# Altium schematic sheet POWER.SchDoc
size Legal
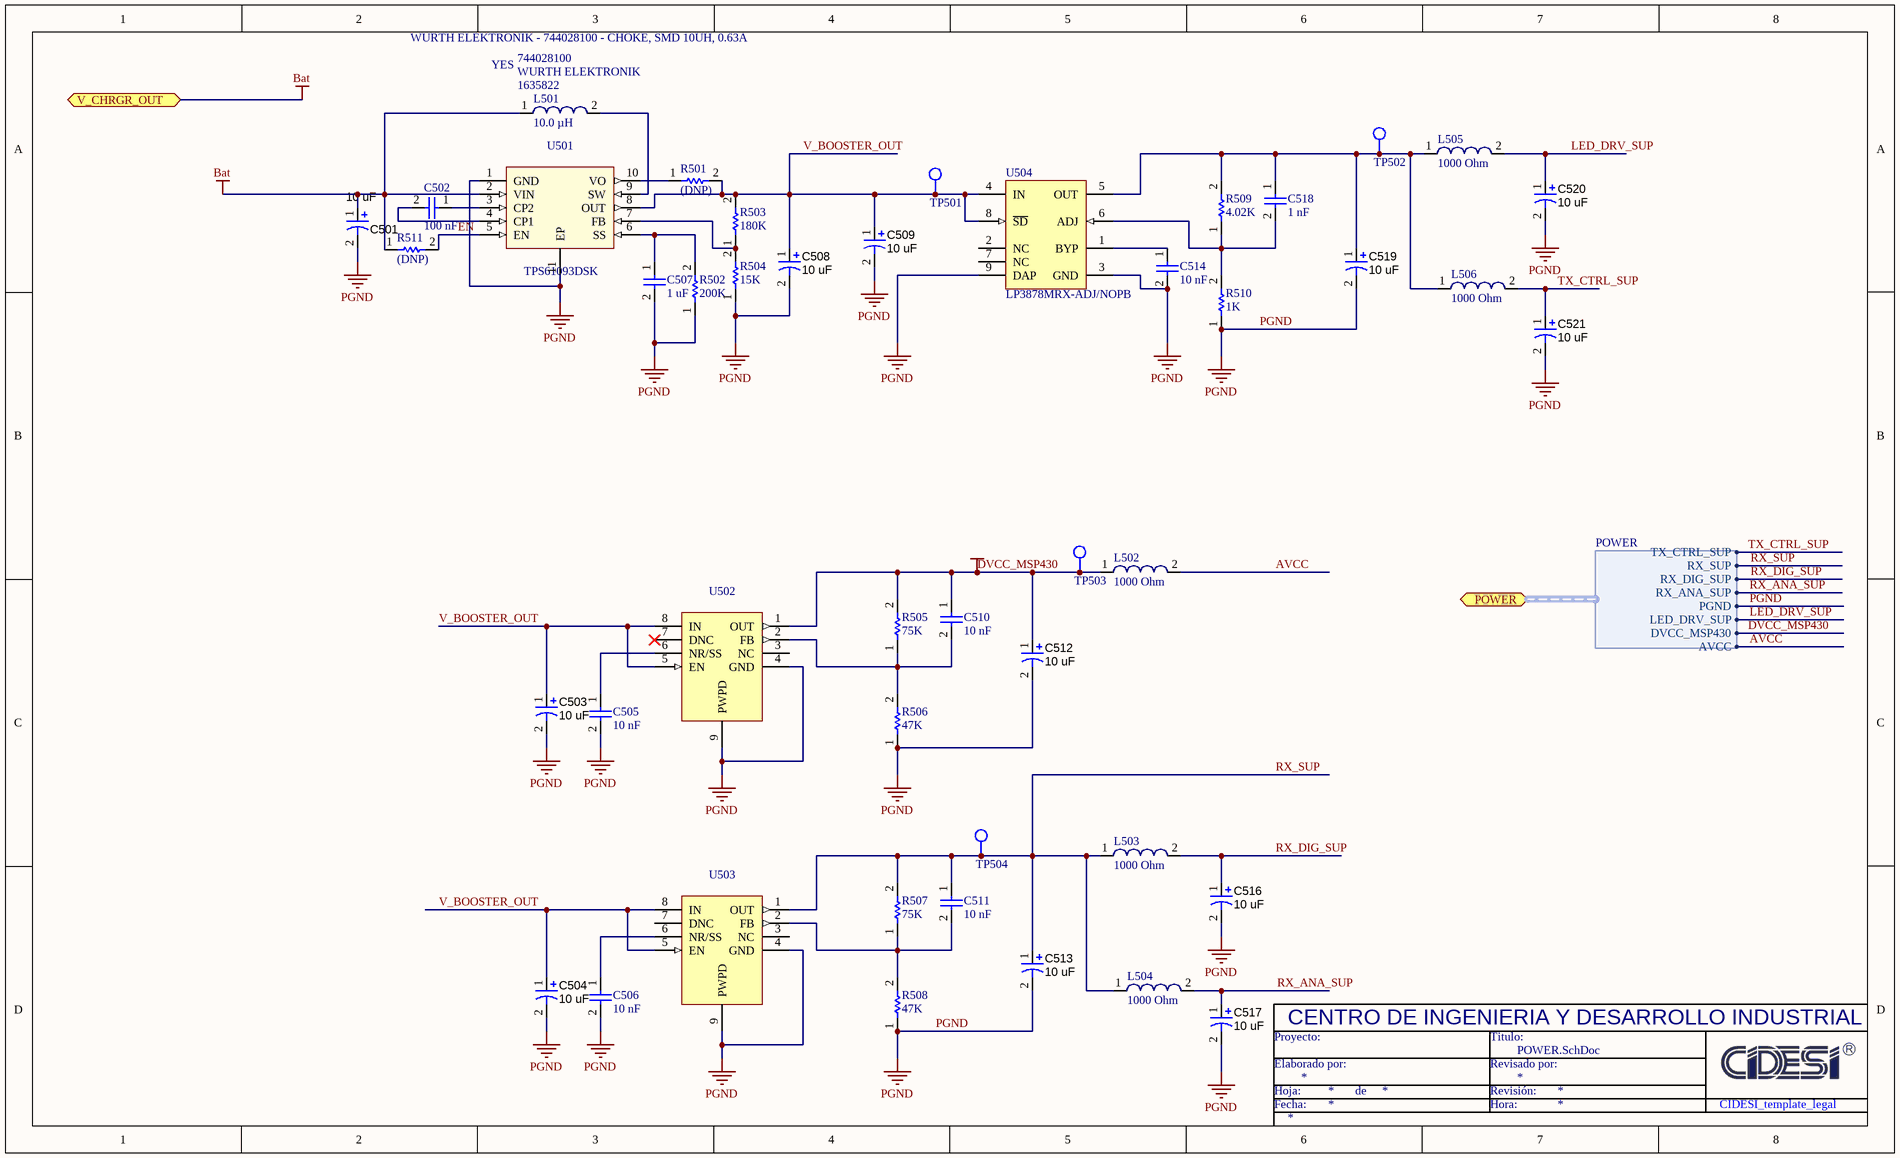
[diagram p0: POWER.SchDoc]

## Parts
C501  10 uF  [C0603_P]
C502  100 nF  [C0402]
C503  10 uF  [C0603_P]
C504  10 uF  [C0603_P]
C505  10 nF  [C0402]
C506  10 nF  [C0402]
C507  1 uF  [C0402]
C508  10 uF  [C0603_P]
C509  10 uF  [C0603_P]
C510  10 nF  [C0402]
C511  10 nF  [C0402]
C512  10 uF  [C0603_P]
C513  10 uF  [C0603_P]
C514  10 nF  [C0402]
C516  10 uF  [C0603_P]
C517  10 uF  [C0603_P]
C518  1 nF  [C0402]
C519  10 uF  [C0603_P]
C520  10 uF  [C0603_P]
C521  10 uF  [C0603_P]
L501  10.0 µH  Supplier Part Number 1: 1635822  Manufacturer 1: WURTH ELEKTRONIK  Manufacturer Part Number 1: 744028100  RoHS 1: YES  Description 1: WURTH ELEKTRONIK - 744028100 - CHOKE, SMD 10UH, 0.63A  [WE-TPC 2811, T]
L502  1000 Ohm  [SMD 0402]
L503  1000 Ohm  [SMD 0402]
L504  1000 Ohm  [SMD 0402]
L505  1000 Ohm  [SMD 0402]
L506  1000 Ohm  [SMD 0402]
R501  (DNP)  [0201]
R502  200K  [0201]
R503  180K  [0201]
R504  15K  [0201]
R505  75K  [0201]
R506  47K  [0201]
R507  75K  [0201]
R508  47K  [0201]
R509  4.02K  [0201]
R510  1K  [0201]
R511  (DNP)  [0201]
TP501  Test Point  [TestPoint]  (value not drawn)  (no BOM)
TP502  Test Point  [TestPoint]  (value not drawn)  (no BOM)
TP503  Test Point  [TestPoint]  (value not drawn)  (no BOM)
TP504  Test Point  [TestPoint]  (value not drawn)  (no BOM)
U501  TPS61093DSK  [DSK]
U502  TPS7A4901DGN  [DGN_8P]  (value not drawn)
U503  TPS7A4901DGN  [DGN_8P]  (value not drawn)
U504  LP3878MRX-ADJ/NOPB  [NGT]

## Ports
POWER (harness POWER), V_CHRGR_OUT (bidir)

## Harnesses
POWER: AVCC, DVCC_MSP430, LED_DRV_SUP, PGND, RX_ANA_SUP, RX_DIG_SUP, RX_SUP, TX_CTRL_SUP

## Nets
Bat: C501.1(+) L501.1 R511.1 U501.2(VIN) ; port V_CHRGR_OUT
DVCC_MSP430: C510.1 C512.1(+) L502.1 R505.2 TP503.1 U502.1(OUT) ; port POWER.DVCC_MSP430
PGND: C501.2(-) C503.2(-) C504.2(-) C505.2 C506.2 C507.2 C508.2(-) C509.2(-) C512.2(-) C513.2(-) C514.2 C516.2(-) C517.2(-) C519.2(-) C520.2(-) C521.2(-) R502.1 R504.1 R506.1 R508.1 R510.1 U501.1(GND) U501.11(EP) U502.4(GND) U502.9(PWPD) U503.4(GND) U503.9(PWPD) U504.3(GND) U504.9(DAP) ; port POWER.PGND
AVCC: L502.2 ; port POWER.AVCC
EN: R511.2 U501.5(EN)
LED_DRV_SUP: C520.1(+) L505.2 ; port POWER.LED_DRV_SUP
RX_ANA_SUP: C517.1(+) L504.2 ; port POWER.RX_ANA_SUP
RX_DIG_SUP: C516.1(+) L503.2 ; port POWER.RX_DIG_SUP
RX_SUP: C511.1 C513.1(+) L503.1 L504.1 R507.2 TP504.1 U503.1(OUT) ; port POWER.RX_SUP
TX_CTRL_SUP: C521.1(+) L506.2 ; port POWER.TX_CTRL_SUP
V_BOOSTER_OUT: C503.1(+) C504.1(+) C508.1(+) C509.1(+) R501.2 R503.2 TP501.1 U501.8(OUT) U502.5(EN) U502.8(IN) U503.5(EN) U503.8(IN) U504.4(IN) U504.8(~{SD})
NetC502_1: C502.1 U501.3(CP2)
NetC502_2: C502.2 U501.4(CP1)
NetC505_1: C505.1 U502.6(NR/SS)
NetC506_1: C506.1 U503.6(NR/SS)
NetC507_1: C507.1 R502.2 U501.6(SS)
NetC510_2: C510.2 R505.1 R506.2 U502.2(FB)
NetC511_2: C511.2 R507.1 R508.2 U503.2(FB)
NetC514_1: C514.1 U504.1(BYP)
NetC518_1: C518.1 C519.1(+) L505.1 L506.1 R509.2 TP502.1 U504.5(OUT)
NetC518_2: C518.2 R509.1 R510.2 U504.6(ADJ)
NetL501_2: L501.2 U501.9(SW)
NetR501_1: R501.1 U501.10(VO)
NetR503_1: R503.1 R504.2 U501.7(FB)

Not connected (* = marked no-connect by the designer): U502 3(NC) 7(DNC)*; U503 3(NC) 7(DNC); U504 2(NC) 7(NC)

## Notes on the sheet
- Proyecto:
- CENTRO DE INGENIERIA Y DESARROLLO INDUSTRIAL
- Titulo:
- Fecha:
- Hoja:
- Elaborado por:
- de
- Hora:
- Revisión:
- Revisado por:
- CIDESI_template_legal

## Library data of the parts
C501 C503 C504 C508 C509 C512 C513 C516 C517 C519-C521 = F981A106MMA: NICHICON - F981A106MMA - CAPACITOR TANT, 10UF, 10V 20%; Product Range: NICHICON - F98 Series; Capacitance: 10; Capacitor Case Style: 0603 ^1608 Metric]; ESR: 7.5; Value: 10 uF; Supplier 1: Farnell; Stock 1: 9201; Pricing 1: 1=0.282, 10=0.236, 100=0.169, 250=0.148, 500=0.131, 1000=0.117 (GBP); Capacitance Tolerance: ± 20%; Voltage Rating: 10; Operating Temperature Max: 125; Series: F98; ComponentLink1URL: http://www.nichicon.co.jp/english/products/pdfs/e-f98.pdf; ComponentLink1Description: http://www.nichicon.co.jp/english/products/pdfs/e-f98.pdf; Supplier Part Number 1: 1853431; Manufacturer 1: NICHICON; Manufacturer Part Number 1: F981A106MMA; RoHS 1: YES; Description 1: NICHICON - F981A106MMA - CAPACITOR TANT, 10UF, 10V 20%; Supplier 2: Mouser; Supplier Part Number 2: 647-F981A106MMA
C502 = C1005X7R1H104M050BB: TDK - C1005X7R1H104M050BB - CAP CERAMIC, 0.1UF, 50V, X7R, 0402; Value: 100 nF; Supplier 1: Farnell; Stock 1: 15712; Pricing 1: 1=0.021, 10=0.012, 100=0.01, 1000=0.009, 4000=0.009, 8000=0.009 (GBP); ComponentLink1URL: http://product.tdk.com/capacitor/mlcc/en/documents/mlcc_commercial_general_en.pdf; ComponentLink1Description: http://product.tdk.com/capacitor/mlcc/en/documents/mlcc_commercial_general_en.pdf; Supplier Part Number 1: 2354090; Manufacturer 1: TDK; Manufacturer Part Number 1: C1005X7R1H104M050BB; RoHS 1: YES; Description 1: TDK - C1005X7R1H104M050BB - CAP CERAMIC, 0.1UF, 50V, X7R, 0402; Supplier 2: Mouser; Supplier Part Number 2: 810-C1005X7R1H104M
C505 C506 C510 C511 C514 = C1005X7R1H103K050BB: TDK - C1005X7R1H103K050BB - CAP CERAMIC, 0.01UF, 50V, X7R, 0402; Product Range: TDK - C Series; Capacitance: 0.01; Capacitance Tolerance: ± 10%; Dielectric Characteristic: X7; Voltage Rating: 50; Capacitor Case Style: 0402 ^1005 Metric]; Value: 10 nF; Supplier 1: Farnell; Stock 1: 36; Pricing 1: 1=0.011, 10=0.005, 100=0.005, 1000=0.005, 2500=0.005 (GBP); Packaging: Cut Tape; MSL: -; ComponentLink1URL: http://product.tdk.com/capacitor/mlcc/en/documents/mlcc_commercial_general_en.pdf; ComponentLink1Description: http://product.tdk.com/capacitor/mlcc/en/documents/mlcc_commercial_general_en.pdf; Supplier Part Number 1: 2354088; Manufacturer 1: TDK; Manufacturer Part Number 1: C1005X7R1H103K050BB; RoHS 1: YES; Description 1: TDK - C1005X7R1H103K050BB - CAP CERAMIC, 0.01UF, 50V, X7R, 0402; Supplier 2: Mouser; Supplier Part Number 2: 810-C1005X7R1H103K
C507 = C1005X5R1E105K050BC: TDK - C1005X5R1E105K050BC - CAP, MLCC, X5R, 1UF, 25V, 0402; Value: 1 uF; Supplier 1: Farnell; Stock 1: 5210; Pricing 1: 1=0.045, 10=0.04, 100=0.036, 250=0.029, 500=0.023, 10000=0.016 (GBP); ComponentLink1URL: http://www.farnell.com/datasheets/1796654.pdf; ComponentLink1Description: http://www.farnell.com/datasheets/1796654.pdf; Supplier Part Number 1: 2346884; Manufacturer 1: TDK; Manufacturer Part Number 1: C1005X5R1E105K050BC; RoHS 1: YES; Description 1: TDK - C1005X5R1E105K050BC - CAP, MLCC, X5R, 1UF, 25V, 0402; Supplier 2: Mouser; Supplier Part Number 2: 810-C1005X5R1E105K
C518 = C1005X7R1E102K050BA: TDK - C1005X7R1E102K050BA - CAPACITOR CERAMIC 1000PF, 25V, X7R, 10%, 0402; Value: 1 nF; Supplier 1: Farnell; Stock 1: 7460; Pricing 1: 1=0.004, 10=0.002, 100=0.002, 1000=0.002, 2500=0.002, 10000=0.002 (GBP); ComponentLink1URL: http://www.farnell.com/datasheets/1571323.pdf; ComponentLink1Description: http://www.farnell.com/datasheets/1571323.pdf; ComponentLink2URL: http://www.farnell.com/datasheets/1718611.pdf; ComponentLink2Description: http://www.farnell.com/datasheets/1718611.pdf; Supplier Part Number 1: 1844132; Manufacturer 1: TDK; Manufacturer Part Number 1: C1005X7R1E102K050BA; RoHS 1: YES; Description 1: TDK - C1005X7R1E102K050BA - CAPACITOR CERAMIC 1000PF, 25V, X7R, 10%, 0402; Supplier 2: Mouser; Supplier Part Number 2: 810-C1005X7R1E102K
L501 = WE-TPC 2811, T, 744028100: SMD Shielded Tiny Power Inductor WE-TPC, L=10.0 µH; Manufacturer: Würth Elektronik eiSos GmbH; partNo: 744028100; Inductance: 10.0 µH; ComponentLink1Description: Manufacturer; ComponentLink1URL: http://www.we-online.de; Created by: Christin Zierenner; Created Date: July 2009; ComponentLink2Description: Datasheet; ComponentLink2URL: http://www.we-online.de/katalog/media/pdf/744028100.pdf; Supplier 1: Farnell; Stock 1: 557; Pricing 1: 1=0.9, 10=0.86, 50=0.84, 100=0.81, 250=0.75 (GBP); ComponentLink3URL: http://www.farnell.com/datasheets/69345.pdf; ComponentLink3Description: http://www.farnell.com/datasheets/69345.pdf; ComponentLink4URL: http://www.farnell.com/cad/1670106.zip; ComponentLink4Description: http://www.farnell.com/cad/1670106.zip
L502-L506 = WE-CBF HF 0402, 742841210: SMD EMI Suppression Ferrite Beads WE-CBF HF, Z= 1000 Ohm; Manufacturer: Würth Elektronik eiSos GmbH; Manufacturer 1: WURTH ELEKTRONIK; Description 1: WURTH ELEKTRONIK - 742841210 - FERRITE BEAD, 1.8OHM, 50MA, 0402; partNo: 742841210; Impedance: 1000 Ohm; ComponentLink1Description: Manufacturer; ComponentLink1URL: http://www.we-online.de; Created by: Christin Zierenner; Created Date: May 2009; ComponentLink2Description: Datasheet; ComponentLink2URL: http://www.we-online.de/katalog/media/pdf/742841210.pdf; Supplier 1: Farnell; Supplier Part Number 1: 1748573; Manufacturer Part Number 1: 742841210; RoHS 1: YES; Stock 1: 220; Pricing 1: 1=0.31, 10=0.219, 50=0.19, 100=0.158, 250=0.126 (GBP); ComponentLink3URL: http://www.farnell.com/datasheets/1696154.pdf; ComponentLink3Description: http://www.farnell.com/datasheets/1696154.pdf; ComponentLink4URL: http://www.farnell.com/cad/1670055.zip; ComponentLink4Description: http://www.farnell.com/cad/1670055.zip; Supplier 2: Mouser; Supplier Part Number 2: 710-742841210
R501 R511 = CRCW02010000Z0ED: VISHAY DALE - CRCW02010000Z0ED - RESISTOR, CHIP, JUMPER, ZERO OHM, 50mW, FULL REEL; Value: 0; Supplier 1: Farnell; Stock 1: 19995; Pricing 1: 10000=0.017, 20000=0.016, 30000=0.015 (GBP); ComponentLink1URL: http://www.vishay.com/docs/20035/dcrcwe3.pdf; ComponentLink1Description: http://www.vishay.com/docs/20035/dcrcwe3.pdf; Supplier Part Number 1: 2316008; Manufacturer 1: VISHAY DALE; Manufacturer Part Number 1: CRCW02010000Z0ED; RoHS 1: YES; Description 1: VISHAY DALE - CRCW02010000Z0ED - RESISTOR, CHIP, JUMPER, ZERO OHM, 50mW, FULL REEL; Supplier 2: Mouser; Supplier Part Number 2: 71-CRCW02010000Z0ED
R502 = CRCW0201200KFNED: VISHAY DALE - CRCW0201200KFNED - RESISTOR, THICK FILM, 200 KOHM, 50 mW, 1%, FULL REEL; Value: 200K; Supplier 1: Farnell; Stock 1: 9995; Pricing 1: 10000=0.007, 20000=0.007, 30000=0.006, 50000=0.006 (GBP); ComponentLink1URL: http://www.farnell.com/datasheets/1700795.pdf; ComponentLink1Description: http://www.farnell.com/datasheets/1700795.pdf; Supplier Part Number 1: 2321987; Manufacturer 1: VISHAY DALE; Manufacturer Part Number 1: CRCW0201200KFNED; RoHS 1: Y-EX; Description 1: VISHAY DALE - CRCW0201200KFNED - RESISTOR, THICK FILM, 200 KOHM, 50 mW, 1%, FULL REEL
R503 = CRCW0201180KFNED: VISHAY DALE - CRCW0201180KFNED - RESISTOR, THICK FILM, 180 KOHM, 50 mW, 1%, FULL REEL; Value: 180K; Supplier 1: Farnell; Stock 1: 19995; Pricing 1: 10000=0.078, 20000=0.078, 30000=0.075, 50000=0.066 (GBP); ComponentLink1URL: http://www.farnell.com/datasheets/1700795.pdf; ComponentLink1Description: http://www.farnell.com/datasheets/1700795.pdf; Supplier Part Number 1: 2321951; Manufacturer 1: VISHAY DALE; Manufacturer Part Number 1: CRCW0201180KFNED; RoHS 1: YES; Description 1: VISHAY DALE - CRCW0201180KFNED - RESISTOR, THICK FILM, 180 KOHM, 50 mW, 1%, FULL REEL
R504 = CRCW020115K0FNED: VISHAY DALE - CRCW020115K0FNED - RESISTOR, THICK FILM, 15 KOHM, 50 mW, 1%, FULL REEL; Value: 15K; Supplier 1: Farnell; Stock 1: 9995; Pricing 1: 10000=0.007, 20000=0.007, 30000=0.007, 50000=0.006 (GBP); ComponentLink1URL: http://www.farnell.com/datasheets/1700795.pdf; ComponentLink1Description: http://www.farnell.com/datasheets/1700795.pdf; Supplier Part Number 1: 2321583; Manufacturer 1: VISHAY DALE; Manufacturer Part Number 1: CRCW020115K0FNED; RoHS 1: YES; Description 1: VISHAY DALE - CRCW020115K0FNED - RESISTOR, THICK FILM, 15 KOHM, 50 mW, 1%, FULL REEL
R505 R507 = CRCW020175K0FNED: VISHAY DALE - CRCW020175K0FNED - RESISTOR, THICK FILM, 75 KOHM, 50 mW, 1%, FULL REEL; Value: 75K; Supplier 1: Farnell; Stock 1: 9995; Pricing 1: 10000=0.007, 20000=0.007, 30000=0.006, 50000=0.006 (GBP); ComponentLink1URL: http://www.farnell.com/datasheets/1700795.pdf; ComponentLink1Description: http://www.farnell.com/datasheets/1700795.pdf; Supplier Part Number 1: 2321623; Manufacturer 1: VISHAY DALE; Manufacturer Part Number 1: CRCW020175K0FNED; RoHS 1: YES; Description 1: VISHAY DALE - CRCW020175K0FNED - RESISTOR, THICK FILM, 75 KOHM, 50 mW, 1%, FULL REEL
R506 R508 = CRCW020147K0FNED: VISHAY DALE - CRCW020147K0FNED - RESISTOR, THICK FILM, 47 KOHM, 50 mW, 1%, FULL REEL; Product Range: VISHAY - CRCW Series; Resistance: 47; Power Rating: 50; Resistor Case Style: 0201 ^0603 Metric]; Value: 47K; Supplier 1: Farnell; Stock 1: 9995; Pricing 1: 10000=0.007, 20000=0.007, 30000=0.006, 50000=0.006 (GBP); Resistance Tolerance: ± 1%; Resistor Element Type: Thick Film; MSL: -; ComponentLink1URL: http://www.farnell.com/datasheets/1700795.pdf; ComponentLink1Description: http://www.farnell.com/datasheets/1700795.pdf; Supplier Part Number 1: 2322005; Manufacturer 1: VISHAY DALE; Manufacturer Part Number 1: CRCW020147K0FNED; RoHS 1: YES; Description 1: VISHAY DALE - CRCW020147K0FNED - RESISTOR, THICK FILM, 47 KOHM, 50 mW, 1%, FULL REEL
R509 = CRCW02014K02FNED: VISHAY DALE - CRCW02014K02FNED - RESISTOR, THICK FILM, 4.02 KOHM, 50 mW, 1%, FULL REEL; Product Range: VISHAY - CRCW Series; Resistance: 4.02; Power Rating: 50; Resistor Case Style: 0201 ^0603 Metric]; Value: 4.02K; Supplier 1: Farnell; Stock 1: 9995; Pricing 1: 10000=0.007, 20000=0.007, 30000=0.007, 50000=0.006 (GBP); Resistance Tolerance: ± 1%; Resistor Element Type: Thick Film; ComponentLink1URL: http://www.farnell.com/datasheets/1700795.pdf; ComponentLink1Description: http://www.farnell.com/datasheets/1700795.pdf; Supplier Part Number 1: 2322928; Manufacturer 1: VISHAY DALE; Manufacturer Part Number 1: CRCW02014K02FNED; RoHS 1: YES; Description 1: VISHAY DALE - CRCW02014K02FNED - RESISTOR, THICK FILM, 4.02 KOHM, 50 mW, 1%, FULL REEL
R510 = CRCW02011K00FNED: VISHAY DALE - CRCW02011K00FNED - RESISTOR, THICK FILM CHIP, 1KOHM 50mW, 1%, FULL REEL; Value: 1K; Supplier 1: Farnell; Pricing 1: 10000=0.022, 20000=0.022, 30000=0.022, 50000=0.019 (GBP); ComponentLink1URL: http://www.vishay.com/docs/20035/dcrcwe3.pdf; ComponentLink1Description: http://www.vishay.com/docs/20035/dcrcwe3.pdf; Supplier Part Number 1: 2321243; Manufacturer 1: VISHAY DALE; Manufacturer Part Number 1: CRCW02011K00FNED; RoHS 1: YES; Description 1: VISHAY DALE - CRCW02011K00FNED - RESISTOR, THICK FILM CHIP, 1KOHM 50mW, 1%, FULL REEL; Supplier 2: Mouser; Supplier Part Number 2: 71-CRCW02011K00FNED
TP501-TP504 = TestPoint
U501 = TPS61093DSK: IC, LOW INPUT BOOST CONVERTER WITH INTEGRATED POWER DIODE AND ISOLATION, SON-10, DSK; MANUFACTURER: TEXAS INSTRUMENTS; Manufacturer Part Number 1: TPS61093DSKR; POPULATE: Y; Description 1: Voltage Regulators - Switching Regulators Low In 20V/1.1A Step Up DC/DC Converter; Number of Outputs: 1; Output Current: 1 A; Output Voltage: 17 V; Switching Frequency: 1.2 MHz; PART NUMBER: TPS61093DSK; CONSIGNED: Y; Supplier 1: Mouser; Supplier Part Number 1: 595-TPS61093DSKR; Manufacturer 1: Texas Instruments; RoHS 1: RoHS Compliant; Category: Voltage Regulators - Switching Regulators; Stock 1: 0; Pricing 1: 3000=1.82 (AUD); Packaging: Reel; Series: TPS61093; Type: Boost Converters; Brand: Texas Instruments; Maximum Operating Temperature: + 85 C; Minimum Operating Temperature: - 40 C; Product Category: Converters - DC/DC; Standard Pack Qty: 3000; RoHS - Mouser: Y; Minimum Order Quantity: 3000; Reeling: True; ComponentLink1URL: http://www.mouser.com/ds/2/405/slvs992a-121117.pdf; ComponentLink1Description: http://www.mouser.com/ds/2/405/slvs992a-121117.pdf
U502 U503 = TPS7A4901DGN: IC, ULTRALOW NOISE, HIGH-PSRR, LDO REGULATOR, VIN 3V TO 35V, 150mA ,MSOP-8, DGN; MANUFACTURER: TEXAS INSTRUMENTS; Manufacturer Part Number 1: TPS7A4901DGNT; POPULATE: Y; Description 1: TEXAS INSTRUMENTS - TPS7A4901DGNT - IC, ADJ LDO REG, 1.2V-33V, 0.15A, MSOP-8; CONSIGNED: Y; PART NUMBER: TPS7A4901DGN; Supplier 1: Farnell; Supplier Part Number 1: 2395583; Manufacturer 1: TEXAS INSTRUMENTS; RoHS 1: YES; Stock 1: 111; Pricing 1: 1=2.501, 10=2.235, 25=2.017, 50=1.92, 100=1.831 (GBP); ComponentLink1URL: http://www.farnell.com/simulation/1746546.zip; ComponentLink1Description: http://www.farnell.com/simulation/1746546.zip; ComponentLink2URL: http://www.ti.com/lit/ds/symlink/tps7a4901.pdf; ComponentLink2Description: http://www.ti.com/lit/ds/symlink/tps7a4901.pdf; ComponentLink3URL: http://www.farnell.com/cad/1610996.zip; ComponentLink3Description: http://www.farnell.com/cad/1610996.zip; Supplier 2: Mouser; Supplier Part Number 2: 595-TPS7A4901DGNT
U504 = LP3878MRX-ADJ/NOPB: Manufacturer 1: TEXAS INSTRUMENTS; Input Voltage Min: 2.5; Input Voltage Max: 16; Output Voltage Min: 1; Output Voltage Max: 5.5; Output Current: 800; Dropout Voltage Vdo: 475; No. of Pins: 8; Description 1: TEXAS INSTRUMENTS - LP3878MRX-ADJ/NOPB - IC, LDO REGULATOR, 800mA, 1-5.5V, FULL REEL; Supplier 1: Newark; Stock 1: 0; Pricing 1: 2500=0.9 (USD); Packaging: Tape & Reel; ComponentLink1URL: http://cache.national.com/ds/LP/LP3878-ADJ.pdf; ComponentLink1Description: http://cache.national.com/ds/LP/LP3878-ADJ.pdf; Supplier Part Number 1: 65K6514; RoHS 1: YES; Manufacturer Part Number 1: LP3878MRX-ADJ/NOPB; Supplier 2: Mouser; Supplier Part Number 2: 926-LP3878MRXADJNOPB